# Altium schematic sheet BandPassFilter.SchDoc
size A
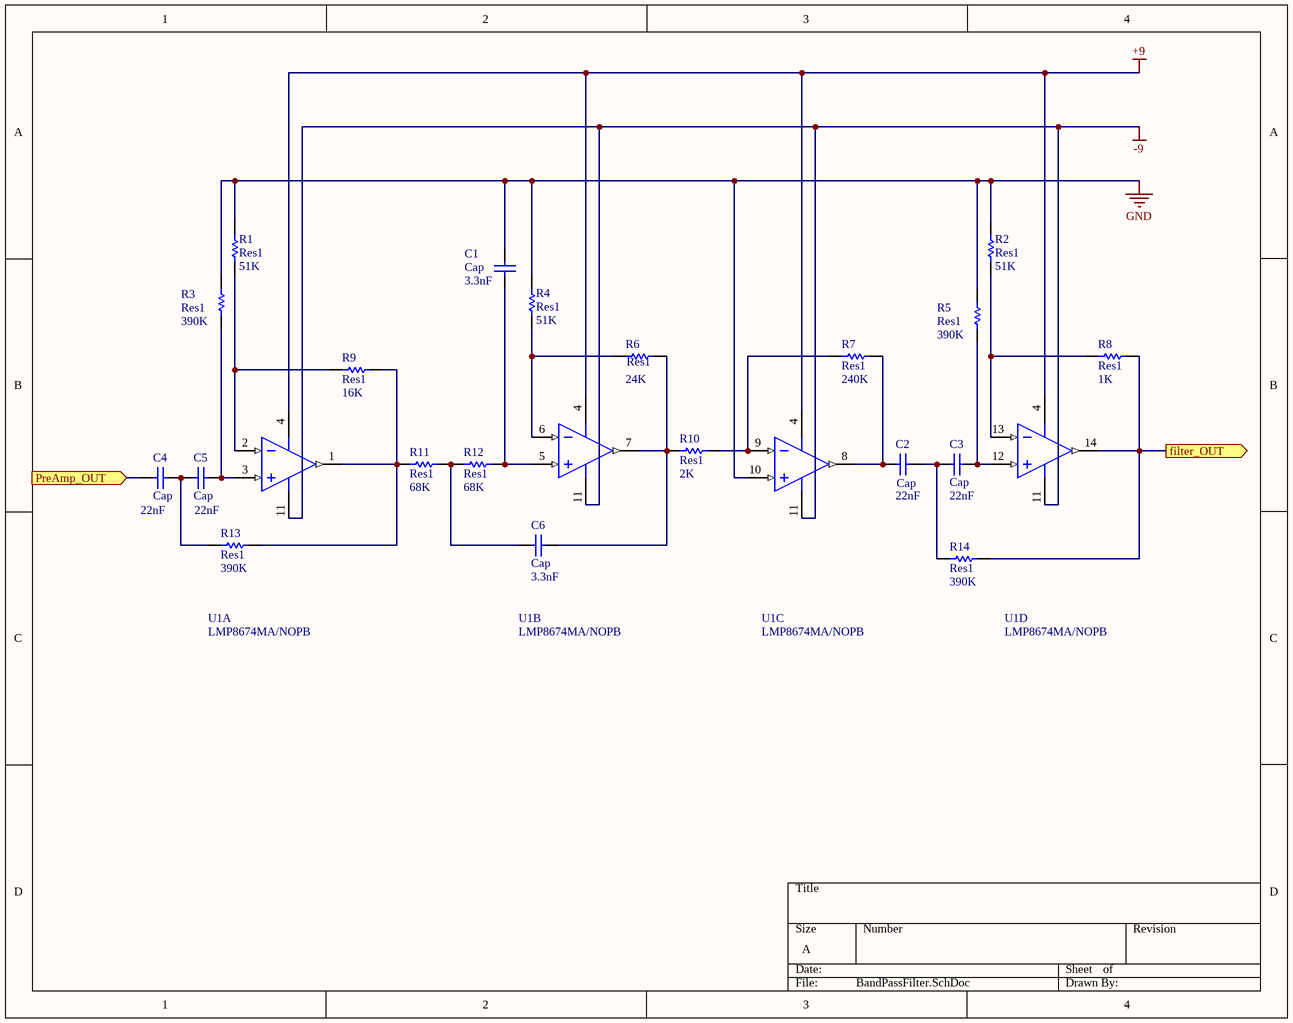
[diagram p0: BandPassFilter.SchDoc]

## Parts
C1  Cap  value 3.3nF  [C0805]
C2  Cap  value 22nF  [C0805]
C3  Cap  value 22nF  [C0805]
C4  Cap  value 22nF  [C0805]
C5  Cap  value 22nF  [C0805]
C6  Cap  value 3.3nF  [C0805]
R1  Res1  value 51K  [6-0805_L]
R2  Res1  value 51K  [6-0805_L]
R3  Res1  value 390K  [6-0805_L]
R4  Res1  value 51K  [6-0805_L]
R5  Res1  value 390K  [6-0805_L]
R6  Res1  value 24K  [6-0805_L]
R7  Res1  value 240K  [6-0805_L]
R8  Res1  value 1K  [6-0805_L]
R9  Res1  value 16K  [6-0805_L]
R10  Res1  value 2K  [6-0805_L]
R11  Res1  value 68K  [6-0805_L]
R12  Res1  value 68K  [6-0805_L]
R13  Res1  value 390K  [6-0805_L]
R14  Res1  value 390K  [6-0805_L]
U1  LMP8674MA/NOPB  [M14A_N]  (parts A,B,C,D of 4)

## Ports
filter_OUT (out), PreAmp_OUT (in)

## Nets
+9: U1.4(V+)
-9: U1.11(V-)
GND: C1.1 R1.2 R2.2 R3.2 R4.1 R5.2 U1.10(IN3+)
filter_OUT: R8.1 R14.1 U1.14(OUT4) ; port filter_OUT
PreAmp_OUT: C4.2 ; port PreAmp_OUT
NetC1_2: C1.2 R12.1 U1.5(IN2+)
NetC2_1: C2.1 R7.2 U1.8(OUT3)
NetC2_2: C2.2 C3.1 R14.2
NetC3_2: C3.2 R5.1 U1.12(IN4+)
NetC4_1: C4.1 C5.2 R13.1
NetC5_1: C5.1 R3.1 U1.3(IN1+)
NetC6_1: C6.1 R6.2 R10.1 U1.7(OUT2)
NetC6_2: C6.2 R11.1 R12.2
NetR1_1: R1.1 R9.1 U1.2(IN1-)
NetR2_1: R2.1 R8.2 U1.13(IN4-)
NetR4_2: R4.2 R6.1 U1.6(IN2-)
NetR7_1: R7.1 R10.2 U1.9(IN3-)
NetR9_2: R9.2 R11.2 R13.2 U1.1(OUT1)

## Library data of the parts
C1-C6 = Cap: Capacitor; Published: 8-Jun-2000; LatestRevisionDate: 17-Jul-2002; LatestRevisionNote: Re-released for DXP Platform.; PackageReference: RAD-0.3; Publisher: Altium Limited; PackageDescription: Radial Cap, Thru-Hole; 2 Leads; 0.3 in Pin Spacing
R1-R14 = Res1: Resistor; Published: 8-Jun-2000; LatestRevisionDate: 17-Jul-2002; LatestRevisionNote: Re-released for DXP Platform.; PackageReference: AXIAL-0.3; Publisher: Altium Limited; PackageDescription: Axial Device, Thru-Hole; 2 Leads; 0.3 in Pin Spacing
U1 = LMP8674MA/NOPB: Quad 40V Low Noise Precision Amplifier, 14-pin Narrow SOIC, 55 Rail; Manufacturer: National Semiconductor; PackageTopMarking: NSUZXYTTE#*LMP8674*MA; PowerWise: N; CompType: Amplifiers; High-Reliability: Y; DatasheetVersion: Jul-2011; PackageVersion: revJ, Jan-1996; PackageReference: M14A; PackageDescription: Molded Package S.O., .150in Wide, 14 Lead; PartNumber: LMP8674MA/NOPB; RoHS: Y; PinCount: 14; Code_JEDEC: MS-012AB; Code_IPC: SOIC127P600-14; ComponentLink1Description: Manufacturer URL; ComponentLink1URL: http://www.national.com/; ComponentLink2Description: LMP8674 Datasheet; ComponentLink2URL: http://www.national.com/ds/LM/LMP8674.pdf; ComponentLink3Description: LMP8674 Web Page; ComponentLink3URL: http://www.national.com/pf/LM/LMP8674.html; ComponentLink4Description: M14A Package Page; ComponentLink4URL: http://www.national.com/packaging/folders/m14a.html